# EAGLE design LoRa Radio 915MHz v1.0 (EAGLE 9.3.2)
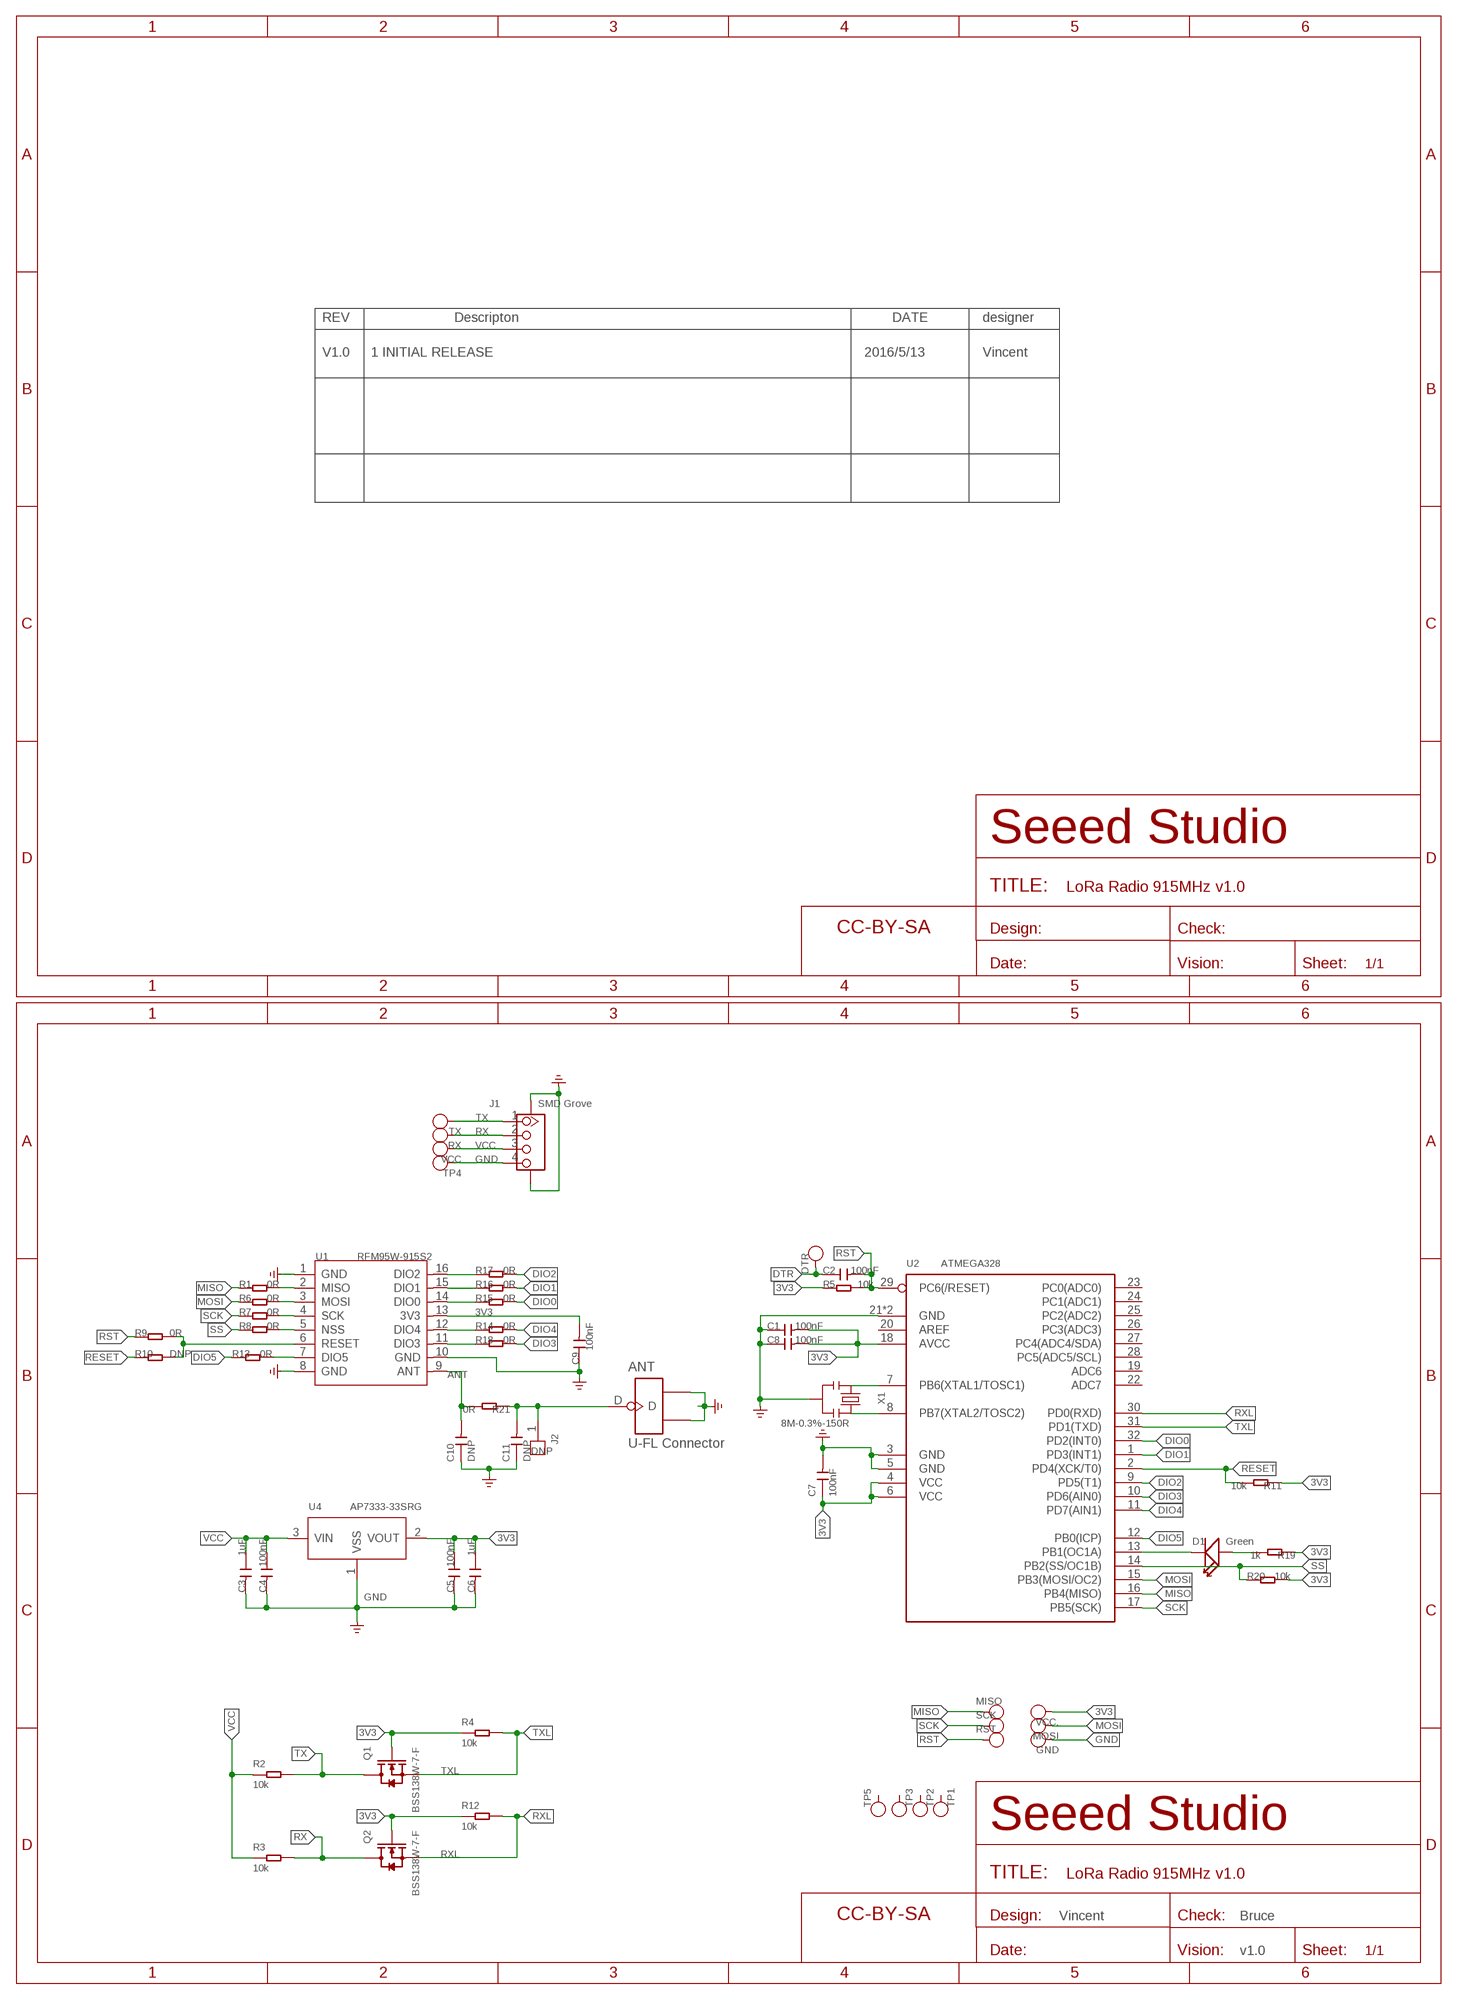
[diagram p0: schematic, sheet 1]

## Parts
ANT  U-FL Connector  ANTENNA-U-FL  [U-FL3P-SMD-2.6X2.6X1.0MM]
C1  100nF  CAP-0402  [C0402]
C2  100nF  CAP-0402  [C0402]
C3  1uF  CAP-0402  [C0402]
C4  100nF  CAP-0402  [C0402]
C5  100nF  CAP-0402  [C0402]
C6  1uF  CAP-0402  [C0402]
C7  100nF  CAP-0402  [C0402]
C8  100nF  CAP-0402  [C0402]
C9  100nF  CAP-0402  [C0402]
C10  DNP  CAP-0402  [C0402]
C11  DNP  CAP-0402  [C0402]
D1  Green  LED-0402  [LED-0402]
DTR  TEST-POINT'4545'  [TP-D45MIL]
FR1  SEEEDSTUDIO-OPEN-SCH-FRAME  [SEEEDSTUDIO-PCB-FRAME]
FR2  SEEEDSTUDIO-OPEN-SCH-FRAME  [SEEEDSTUDIO-PCB-FRAME]
GND  DNP  PAD-TEST-POINT'4545'  [TP-D45MIL]
J1  SMD Grove  GROVE-CONNECTOR-SMD'DD'  [HW4-SMD-2.0]
J2  DNP  HEADER-1P-35  [1P-65/35MIL]
MISO  DNP  PAD-TEST-POINT'4545'  [TP-D45MIL]
MOSI  DNP  PAD-TEST-POINT'4545'  [TP-D45MIL]
Q1  BSS138W-7-F  MOSFET-N'SI1304BDL'  [SOT-323]
Q2  BSS138W-7-F  MOSFET-N'SI1304BDL'  [SOT-323]
R1  0R  RES-0402  [R0402]
R2  10k  RES-0402  [R0402]
R3  10k  RES-0402  [R0402]
R4  10k  RES-0402  [R0402]
R5  10k  RES-0402  [R0402]
R6  0R  RES-0402  [R0402]
R7  0R  RES-0402  [R0402]
R8  0R  RES-0402  [R0402]
R9  0R  RES-0402  [R0402]
R10  DNP  RES-0402  [R0402]
R11  10k  RES-0402  [R0402]
R12  10k  RES-0402  [R0402]
R13  0R  RES-0402  [R0402]
R14  0R  RES-0402  [R0402]
R15  0R  RES-0402  [R0402]
R16  0R  RES-0402  [R0402]
R17  0R  RES-0402  [R0402]
R18  0R  RES-0402  [R0402]
R19  1k  RES-0402  [R0402]
R20  10k  RES-0402  [R0402]
R21  0R  R-0603  [R0603]
RST  DNP  PAD-TEST-POINT'4545'  [TP-D45MIL]
RX  TEST-POINT'4545'  [TP-D45MIL]
SCK  DNP  PAD-TEST-POINT'4545'  [TP-D45MIL]
TP1  TEST-POINT'4545'  [TP-D45MIL]
TP2  TEST-POINT'4545'  [TP-D45MIL]
TP3  TEST-POINT'4545'  [TP-D45MIL]
TP4  TEST-POINT'4545'  [TP-D45MIL]
TP5  TEST-POINT'4545'  [TP-D45MIL]
TX  TEST-POINT'4545'  [TP-D45MIL]
U1  RFM95W-915S2  MOUDLE-MODEM-RFM95/96/97/98  [MODEM16-2-16X16X1.8MM]
U2  ATMEGA328  MCU-ATMEGA8/168/328MU  [QFN32G-0.5-5X5MM]
U4  AP7333-33SRG  PMIC-XC6206PMR  [SOT-23]
VCC  TEST-POINT'4545'  [TP-D45MIL]
VCC.  NC  PAD-TEST-POINT'4545'  [TP-D45MIL]
X1  8M-0.3%-150R  CRYSTAL-RESONATOR'SMD'  [RESONATOR3-SMD-3.6X1.3X0.8MM]

## Nets
3V3: C1.2 C5.1 C6.1 C7.1 C8.2 C9.2 Q1.1(G) Q2.1(G) R4.1 R5.2 R11.2 R12.1 R19.2 R20.2 U1.13(3V3) U2.4(VCC) U2.6(VCC) U2.18(AVCC) U4.2(VOUT) VCC..T
ANT: C10.2 R21.2 U1.9(ANT)
DIO0: R15.2 U2.32(PD2(INT0))
DIO1: R16.2 U2.1(PD3(INT1))
DIO2: R17.2 U2.9(PD5(T1))
DIO3: R18.2 U2.10(PD6(AIN0))
DIO4: R14.2 U2.11(PD7(AIN1))
DIO5: R13.1 U2.12(PB0(ICP))
DTR: C2.1 DTR.T
GND: ANT.GND1 ANT.GND2 C1.1 C3.2 C4.2 C5.2 C6.2 C7.2 C8.1 C9.1 C10.1 C11.1 GND.T J1.4 J1.SS1 J1.SS2 TP4.T U1.1(GND) U1.8(GND) U1.10(GND) U2.3(GND) U2.5(GND) U2.21(GND) U2.33(GND) U4.1(VSS) X1.2 ; supply symbol labelled GND_POWER
MISO: MISO.T R1.1 U2.16(PB4(MISO))
MOSI: MOSI.T R6.1 U2.15(PB3(MOSI/OC2))
N$1: R13.2 U1.7(DIO5)
N$2: R17.1 U1.16(DIO2)
N$3: R9.1 R10.1 U1.6(RESET)
N$4: R16.1 U1.15(DIO1)
N$5: R15.1 U1.14(DIO0)
N$6: R14.1 U1.12(DIO4)
N$7: R1.2 U1.2(MISO)
N$8: R6.2 U1.3(MOSI)
N$9: R7.2 U1.4(SCK)
N$10: R8.2 U1.5(NSS)
N$11: R18.1 U1.11(DIO3)
N$12: D1.- U2.13(PB1(OC1A))
N$13: D1.+ R19.1
N$14: ANT.D C11.2 J2.1 R21.1
RESET: R10.2 R11.1 U2.2(PD4(XCK/T0))
RST: C2.2 R5.1 R9.2 RST.T U2.29(PC6(/RESET))
RX: J1.2 Q2.3(D) R3.2 RX.T
RXL: Q2.2(S) R12.2 U2.30(PD0(RXD))
SCK: R7.1 SCK.T U2.17(PB5(SCK))
SS: R8.1 R20.1 U2.14(PB2(SS/OC1B))
TX: J1.1 Q1.3(D) R2.2 TX.T
TXL: Q1.2(S) R4.2 U2.31(PD1(TXD))
VCC: C3.1 C4.1 J1.3 R2.1 R3.1 U4.3(VIN) VCC.T
XTAL1: U2.7(PB6(XTAL1/TOSC1)) X1.1
XTAL2: U2.8(PB7(XTAL2/TOSC2)) X1.3
Unconnected: TP1.T TP2.T TP3.T TP5.T U2.19(ADC6) U2.20(AREF) U2.22(ADC7) U2.23(PC0(ADC0)) U2.24(PC1(ADC1)) U2.25(PC2(ADC2)) U2.26(PC3(ADC3)) U2.27(PC4(ADC4/SDA)) U2.28(PC5(ADC5/SCL))

## Notes on the sheet
- REV | Descripton | DATE | designer
- V1.0 | 1 INITIAL RELEASE | 2016/5/13 | Vincent
- Vincent | Bruce
- v1.0

## Library data of the parts
ANT = Connector-new:ANTENNA-U-FL: 320110048
C1-C11 = Discrete-new:CAP: Ceramic Capacitors
D1 = Discrete-new:LED
DTR RX TP1-TP5 TX VCC = Discrete-new:TEST-POINT; PARTNO: DNP
FR1 FR2 = moudle-new:SEEEDSTUDIO-OPEN-SCH-FRAME
GND MISO MOSI RST SCK VCC. = Discrete-new:PAD-TEST-POINT; PARTNO: DNP
J1 = Connector-new:GROVE-CONNECTOR-SMD: 4P-SMD-2.0:320110030;4P-SMD-2.0-90D:320110032
J2 = Connector-new:HEADER-1P
Q1 Q2 = Discrete-new:MOSFET-N
R1-R20 = Discrete-new:RES
R21 = Discrete-smallsmall:R*
U1 = moudle-new:MOUDLE-MODEM-RFM95/96/97/98
U2 = IC-new:MCU-ATMEGA8/168/328
U4 = IC-new:PMIC-XC6206P: LOW ESR Cap.Compatible Positive Voltage Regulators
X1 = Discrete-new:CRYSTAL-RESONATOR: Resonator Small SMD resonator. This is the itty bitty 10/20MHz resonators with built in caps. CSTCE10M0G55 and CSTCE20M0V53. Footprint has been reviewed closely but hasn't been tested yet.

## Net classes
0 default: width 0.152 mm, drill 0.254 mm, clearance 0.152 mm

## Board
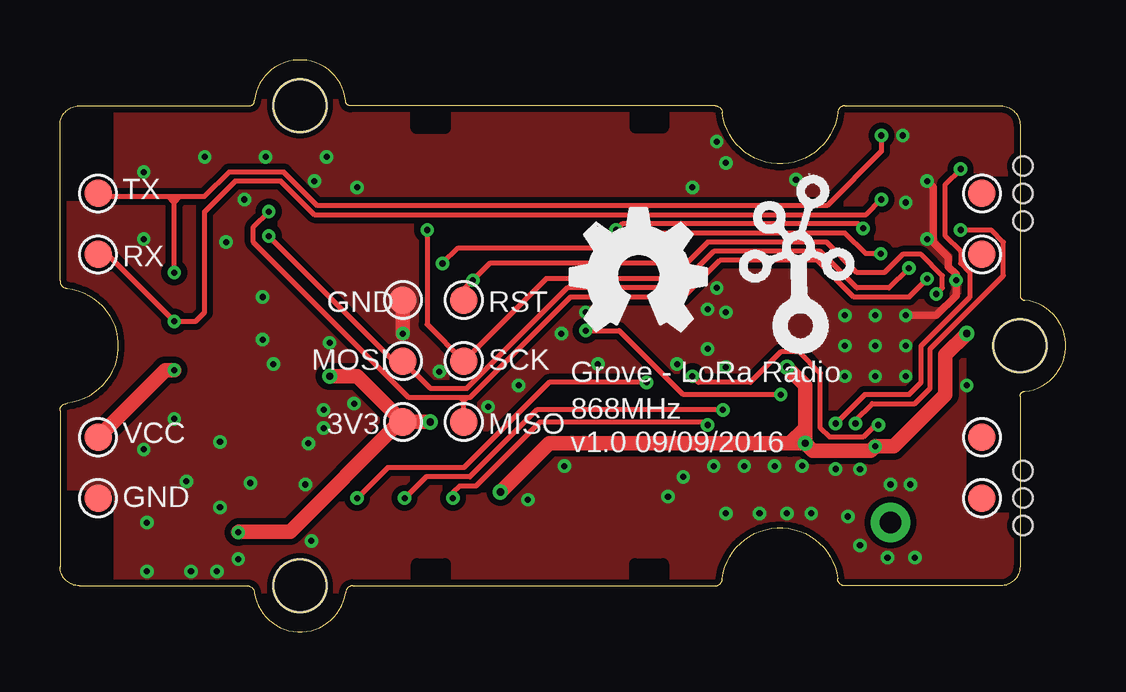
[diagram p1: board, top side]
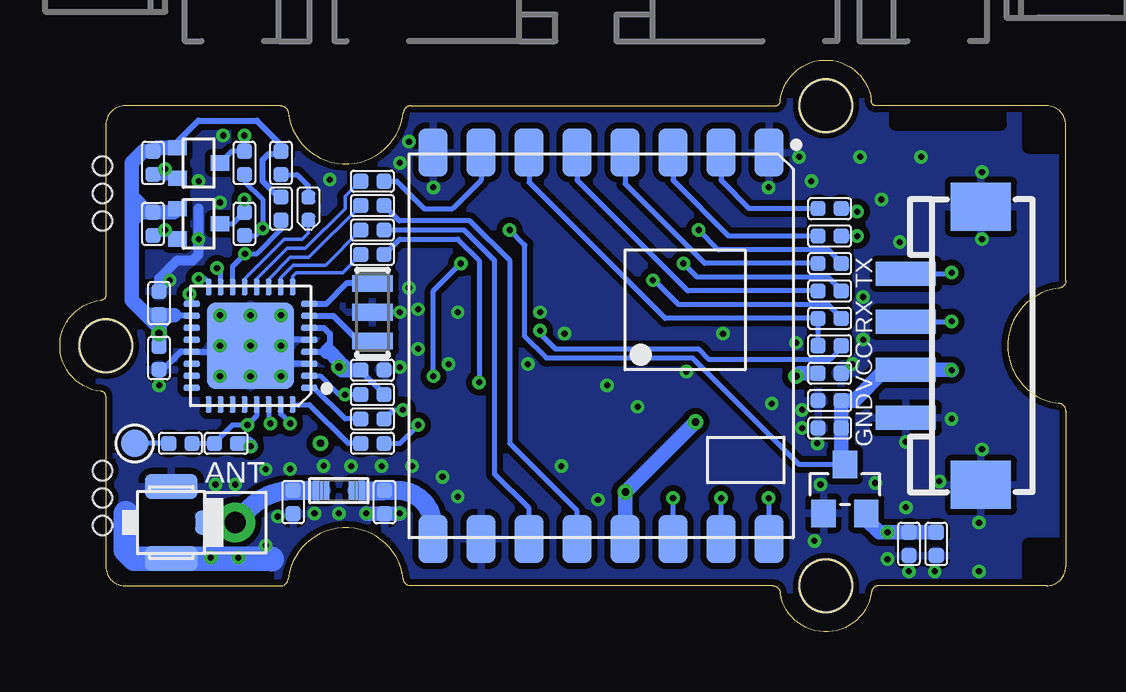
[diagram p2: board, bottom side, seen from below]

Size 41.91 x 23.83 mm. Coordinates in mm from the lower left corner, seen from the top.
Copper layers (1*16): Top 0.035mm / dielectric 1.5mm / Bottom 0.035mm
Design rules "SeeedStudio_2layer_DRU_no_angle_20140221 *": minimum track width 6mil, minimum drill 10mil, track to track 6mil, track to pad 6mil, pad to pad 6mil, via to via 6mil, smd to smd 0mil, copper to edge 10mil, drill to drill 10mil, minimum pad ring 10mil, minimum via ring 6mil, stop-mask expansion 2mil, vias tented up to drill 25mil, thermal gap 10mil
Holes 0.8 mm at 40.13,6.71 40.13,4.43 40.13,5.57 40.13,19.41 40.13,17.13 40.13,18.27

### Footprints (pad centres in the part's own frame; a part is rotated, then mirrored left to right if it is on the bottom)
U-FL3P-SMD-2.6X2.6X1.0MM = smd 1.05 x 1: D -1.524,0 | smd 2.2 x 1.05: GND1 0,1.5; GND2 0,-1.5
C0402 = smd 0.635 x 0.635: 1 0,0.484; 2 0,-0.484
LED-0402 = smd 0.58 x 0.58: + -0.468,0; - 0.468,0
TP-D45MIL = smd 1.143 x 1.143: T 0,0
HW4-SMD-2.0 = smd 1 x 2.5: 1 -3,0; 2 -1,0; 3 1,0; 4 3,0 | smd 2 x 2.5: SS1 -5.8,3.123; SS2 5.8,3.123
1P-65/35MIL = drill 0.889 pad 1.651: 1 0,0
SOT-323 = smd 0.635 x 0.762: 1 -0.635,-0.889; 2 0.635,-0.889; 3 0,0.889
R0402 = smd 0.635 x 0.635: 1 0,0.484; 2 0,-0.484
R0603 = smd 0.7 x 0.8: 1 -0.75,0; 2 0.75,0
MODEM16-2-16X16X1.8MM = smd 2 x 1.2: 1 -8.046,7; 2 -8.046,5; 3 -8.046,3; 4 -8.046,1; 5 -8.046,-1; 6 -8.046,-3; 7 -8.046,-5; 8 -8.046,-7; 9 8.046,-7; 10 8.046,-5; 11 8.046,-3; 12 8.046,-1; 13 8.046,1; 14 8.046,3; 15 8.046,5; 16 8.046,7
QFN32G-0.5-5X5MM = smd 0.7 x 0.25: 1 -2.45,1.75; 2 -2.45,1.25; 3 -2.45,0.75; 4 -2.45,0.25; 5 -2.45,-0.25; 6 -2.45,-0.75; 7 -2.45,-1.25; 8 -2.45,-1.75; 17 2.45,-1.75; 18 2.45,-1.25; 19 2.45,-0.75; 20 2.45,-0.25; 21 2.45,0.25; 22 2.45,0.75; 23 2.45,1.25; 24 2.45,1.75 | smd 0.25 x 0.7: 9 -1.75,-2.45; 10 -1.25,-2.45; 11 -0.75,-2.45; 12 -0.25,-2.45; 13 0.25,-2.45; 14 0.75,-2.45; 15 1.25,-2.45; 16 1.75,-2.45; 25 1.75,2.45; 26 1.25,2.45; 27 0.75,2.45; 28 0.25,2.45; 29 -0.25,2.45; 30 -0.75,2.45; 31 -1.25,2.45; 32 -1.75,2.45 | smd 3.6 x 3.6: 33 0,0
SOT-23 = smd 1.016 x 1.143: 1 -0.889,-1.016; 2 0.889,-1.016; 3 0,1.016
GROVE-1*2-TEST-PLATFORM-TOP = hole 2.2: 10.635,10; 10.635,-10; -19.365,0
RESONATOR3-SMD-3.6X1.3X0.8MM = smd 0.7 x 1.7: 1 -1.2,0; 2 0,0; 3 1.2,0

### Placement (x,y rotation side)
ANT  37.27,4.56 180 bottom
C1  37.78,13.7 0 bottom
C2  36.89,7.86 90 bottom
C3  9.84,9.64 270 bottom
C4  9.84,8.49 270 bottom
C5  5.4,3.67 0 bottom
C6  6.54,3.67 0 bottom
C7  28.89,10.91 90 bottom
C8  37.78,11.41 180 bottom
C9  9.84,10.78 270 bottom
C10  28.38,5.41 180 bottom
C11  32.19,5.41 180 bottom
D1  31.56,17.64 270 bottom
DTR  38.8,7.86 180 bottom
FR1  45.91,-14.37 0 bottom  (outside the outline)
FR2  50.73,-21.48 0 bottom  (outside the outline)
GND  14.29,13.83 0 top
J1  6.67,11.92 270 bottom
J2  34.61,4.56 0 bottom
MISO  16.83,8.75 0 top
MOSI  14.29,11.29 0 top
Q1  36.13,19.54 270 bottom
Q2  36.13,17 270 bottom
R1  9.84,17.64 270 bottom
R2  34.22,19.54 180 bottom
R3  34.22,17 180 bottom
R4  38.03,19.54 0 bottom
R5  34.99,7.86 90 bottom
R6  9.84,16.49 270 bottom
R7  9.84,15.35 270 bottom
R8  9.84,14.21 270 bottom
R9  9.84,13.06 90 bottom
R10  9.84,11.92 90 bottom
R11  28.89,9.89 90 bottom
R12  38.03,17 0 bottom
R13  28.89,18.78 90 bottom
R14  28.89,17.76 270 bottom
R15  28.89,7.86 270 bottom
R16  28.89,8.87 270 bottom
R17  28.89,15.73 270 bottom
R18  28.89,16.75 270 bottom
R19  32.7,19.54 180 bottom
R20  32.7,17.64 180 bottom
R21  30.29,5.89 0 bottom
RST  16.83,13.83 0 top
RX  1.59,15.73 180 top
SCK  16.83,11.29 0 top
TP1  38.42,5.57 0 top
TP2  38.42,15.73 180 top
TP3  38.42,18.27 180 top
TP4  1.59,5.57 180 top
TP5  38.42,8.11 180 top
TX  1.59,18.27 0 top
U1  19.37,11.92 270 bottom
U2  33.97,11.92 180 bottom
U4  9.21,5.95 0 bottom
U$2  [OSHW_FILLX200_NOTEXT]  21.27,12.56 0 top
U$4  [GROVE-1*2-TEST-PLATFORM-TOP]  20.64,11.92 0 bottom
U$8  [GROVE-SILK-BIG]  30.8,12.56 0 top
VCC  1.59,8.11 180 top
VCC.  14.29,8.75 0 top
X1  28.89,13.32 90 bottom

### Tracks (layer width: path | path; a pad name or v marks a point on that pad's centre or on a via)
3V3  (via drill 0.25 pad 0.51, 0.3 pad 0.64)
  Top 0.61: v15.43,8.75 VCC..T 14.16,8.75 | v37.78,12.43 36.89,11.54 36.89,9.89 34.73,7.73 v33.97,7.73 33.78,7.54 31.37,7.54 v31.05,7.86 | 14.16,8.75 9.59,4.17 7.45,4.17 v7.43,4.15 | 14.16,8.75 14.16,8.87 12.38,10.65 v11.24,10.65 | v31.05,7.86 31.05,8.49 | 31.05,8.49 31.05,10.27 v30.29,11.03 | v31.05,7.86 30.41,7.86 | 30.41,7.86 20.38,7.86 v18.35,5.83 | 30.41,7.86 31.05,8.49
  Bottom 0.254: U2.6 30.91,12.67 30.67,12.43 30.67,12.05 | 30.67,12.05 30.67,11.67 | U2.4 30.8,11.67 | 30.67,12.05 30.92,11.79 | U2.18 37.12,13.17 37.14,13.19 | R11.2 28.41,9.91 29.37,10.88 C7.1 | Q1.1 37.02,20.43 36.14,21.31 33.7,21.31 32.7,20.3 R19.2 | 32.7,19.92 R19.2 | R20.2 32.8,18.12 33.46,18.78 33.46,19.67 33.21,19.92 32.8,19.92 R19.2
  Bottom 0.61: U1.13 18.37,3.79 | 18.37,3.79 18.37,3.43 18.35,3.41 18.36,3.41 18.37,3.42 | 30.8,11.67 30.67,11.67 30.29,11.29 | 30.29,11.29 v30.29,11.03 30.16,10.91 C7.1 | 30.03,11.03 30.29,11.29 | 37.4,13.19 37.76,13.19 | 37.76,13.19 C1.2 38.31,13.22 38.92,13.83 38.92,17.13 | 37.76,13.19 37.76,12.45 v37.78,12.43 | v37.78,12.43 37.78,12.68 38.29,13.19 | 37.14,13.19 37.4,13.19 | 37.4,13.19 37.78,12.81 | C8.2 v37.78,12.43 | 18.37,5.81 v18.35,5.83 | v18.35,5.83 v15.43,8.75 | U4.2 8.32,4.68 7.78,4.15 v7.43,4.15 5.52,4.15 | 5.52,4.15 C5.1 | C6.1 5.52,4.15 | C9.2 11.11,10.78 v11.24,10.65 | 38.92,17.13 38.92,17.51 | 38.92,17.51 38.92,19.54 38.44,20.03 R4.1 37.88,20.18 Q1.1 | R12.1 38.9,17.49 38.92,17.51 | R12.1 37.17,17.49 Q2.1 | R12.1 38.26,17.49 38.8,18.02 | R12.1 38.57,17.49 38.92,17.13 | v18.35,5.83 18.35,3.81 18.37,3.79 | R5.2 34.1,7.86 v33.97,7.73
ANT
  Bottom 0.61: 26.37,3.42 26.37,3.79 U1.9
  Bottom 0.711: 26.35,3.89 U1.9 | 26.37,3.79 26.35,3.81 26.35,4.35
  Bottom 0.787: R21.2 C10.2 27.84,5.89 arc90 26.37,4.41 26.37,3.42
DIO0
  Bottom 0.203: U2.32 31.52,9.47 29.91,7.86 R15.2
DIO1
  Bottom 0.203: R16.2 30.03,8.87 31.33,10.17 U2.1
DIO2
  Bottom 0.152: U2.9 32.22,14.81 32.06,14.97 30.14,14.97 R17.2
DIO3
  Bottom 0.152: U2.10 32.72,14.76 32.19,15.29 30.84,15.29 R18.2
DIO4
  Bottom 0.152: U2.11 33.22,14.7 32.32,15.6 31.53,15.6 R14.2
DIO5
  Bottom 0.152: U2.12 33.72,14.71 32.45,15.99 31.68,15.99 30.03,17.64 30.03,18.14 29.4,18.78 R13.1
DTR
  Bottom 0.203: C2.1 DTR.T
GND  (via drill 0.25 pad 0.51)
  Top 0.305: v35.24,13.19 36.51,13.19 37.34,14.02 v37.34,14.65 37.34,14.91 37.02,15.22 37.02,15.6 36.38,16.24 36.38,18.53 v36.13,18.78
  Top 0.61: GND.T v14.29,12.43
  Bottom 0.254: U2.5 32.45,12.17 v32.7,11.92 | U2.3 32.18,11.17 v32.7,10.65 | v35.24,11.92 35.49,11.67 U2.21 36.89,11.67 37.63,10.93 C8.1 v37.78,10.27
  Bottom 0.305: C1.1 37.78,14.21 37.4,14.59
  Bottom 0.406: C9.1 9.27,10.78 v8.89,11.16 | ANT.GND1 35.66,3.06 v35.62,3.1 v34.48,3.1 33.84,3.1 v33.34,3.6 | C1.1 37.78,14.72 37.02,15.48 36.38,15.48 36.13,15.73 36.13,17.64
  Bottom 0.61: v29.14,4.94 29.13,4.92 C10.1 27.76,4.92 v27.75,4.94
  Bottom 1.016: 39.18,4.94 39.18,3.41 38.82,3.06 ANT.GND1 33.11,3.06 33.08,3.03
  other vias: 33.97,11.92 35.24,10.65 33.97,10.65 32.7,13.19 33.97,13.19 33.34,6.78 34.61,6.14 35.43,6.14 32.32,6.79 30.92,6.91 29.78,6.9 28.51,6.9 27.24,6.9 10.98,8.49 10.98,9.25 3.49,16.37 3.49,19.16 4.76,8.87 3.49,7.6 3.62,2.52 7.43,3.03 5.46,2.52 10.35,7.86 11.11,19.8 10.6,18.78 8.57,19.8 6.03,19.8 22.41,11.16 19.11,10.27 25.97,6.46 25.33,5.63 10.22,6.14 6.67,7.92 5.27,6.27 15.81,10.84 35.24,17.89 30.67,18.84 12.25,9.51 7.68,18.02 6.92,16.24 8.44,13.95 8.44,12.18 11.24,12.05 6.54,2.52 10.48,3.79 27.75,11.03 27.75,13.32 25.71,11.16 26.99,11.79 27.37,14.33 26.99,13.45 25.33,13.32 20.89,12.43 21.91,13.32 17.84,9.38 6.67,5.19 3.62,4.56 36.13,16.37 27.75,19.54 27.37,20.43 7.94,6.21 35.11,20.68 32.83,4.81 31.3,4.94 30.29,4.94 21.02,6.9 19.49,5.51 26.35,18.53 12.38,18.53
  pour Top (isolate 0.254, rank 6): 40.32,22.08 -0.32,22.08 -0.32,1.76 40.32,1.76
  pour Bottom (isolate 0.254, rank 6): 40.32,22.08 -0.32,22.08 -0.32,1.76 40.32,1.76
MISO  (via drill 0.25 pad 0.51)
  Top 0.203: 16.95,9.76 17.08,9.76 21.27,13.95 25.97,13.95 27.49,15.48 31.56,15.48 33.08,13.95 35.37,13.95 v36.13,14.72 | 16.95,9.76 16.83,9.76 | 16.83,9.76 16.7,9.76 | MISO.T 16.83,9.64 | 16.83,9.64 16.83,9.76 | 16.83,9.64 16.95,9.76 | 16.83,9.64 16.7,9.76 | 16.7,9.76 14.54,9.76 8.06,16.24 8.06,16.87 v8.7,17.51
  Bottom 0.203: U2.16 35.72,14.56 35.88,14.72 v36.13,14.72 | R1.1 8.82,17.64 v8.7,17.51
MOSI  (via drill 0.25 pad 0.51)
  Top 0.203: v35.37,15.16 34.54,14.33 33.21,14.33 31.68,15.86 27.24,15.86 25.71,14.33 21.14,14.33 16.95,10.14 15.43,10.14 MOSI.T 13.9,11.29 v8.7,16.49
  Bottom 0.203: U2.15 35.22,15.01 v35.37,15.16 | R6.1 v8.7,16.49
N$1
  Bottom 0.203: 24.37,20.42 U1.7 24.37,18.82 25.55,17.64 26.73,17.64 27.87,18.78 R13.2
N$2  (via drill 0.25 pad 0.51)
  Top 0.203: v24.45,10.4 20.38,10.4 16.83,6.84 13.65,6.84 v12.38,5.57
  Bottom 0.203: R17.1 28.38,15.73 27.75,16.37 25.33,16.37 24.45,15.48 v24.45,10.4 | 12.37,3.42 U1.16 12.38,3.89 v12.38,5.57
N$3
  Bottom 0.203: R10.1 R9.1 16.7,13.06 22.37,18.73 U1.6 22.37,20.42
N$4  (via drill 0.25 pad 0.51)
  Top 0.203: v14.36,5.57 15.25,6.46 17.08,6.46 19.87,9.25 v27.62,9.25
  Bottom 0.203: R16.1 28.38,8.87 28,9.25 v27.62,9.25 | 14.37,3.42 U1.15 v14.37,5.57 v14.36,5.57
N$5  (via drill 0.25 pad 0.51)
  Top 0.203: v26.99,8.62 26.86,8.75 20,8.75 17.33,6.08 16.65,6.08 16.37,5.8 v16.37,5.57
  Bottom 0.203: R15.1 27.75,7.86 v26.99,8.62 | 16.37,3.42 U1.14 16.37,4.6 16.37,4.61 v16.37,5.57
N$6
  Bottom 0.203: R14.1 27.77,17.13 24.83,17.13 23.18,15.48 23.18,7.86 20.37,5.05 U1.12 20.37,3.42
N$7
  Bottom 0.203: R1.2 13.18,17.64 14.37,18.82 U1.2 14.37,20.38 14.41,20.43 14.37,20.43 14.37,20.42
N$8
  Bottom 0.203: R6.2 14.04,16.49 16.37,18.82 U1.3 16.37,20.42
N$9
  Bottom 0.203: R7.2 15.05,15.35 18.37,18.67 U1.4 18.37,20.42
N$10
  Bottom 0.203: R8.2 15.75,14.21 20.37,18.82 U1.5 20.37,20.41 20.38,20.43 20.37,20.43 20.37,20.42
N$11
  Bottom 0.203: 22.37,3.42 U1.11 22.37,5.14 23.81,6.59 23.81,15.48 25.08,16.75 R18.1
N$12
  Bottom 0.152: U2.13 34.22,14.72 32.57,16.37 31.81,16.37 31.56,16.62 D1.-
  Bottom 0.254: D1.- 31.56,17.26
N$13
  Bottom 0.203: R19.1 32.03,19.06 31.56,18.59 D1.+
N$14
  Bottom 0.787: ANT.D J2.1 33.99,5.17 arc45 32.25,5.89 C11.2 R21.1
RESET  (via drill 0.25 pad 0.51)
  Top 0.203: v21.91,12.56 23.3,12.56 25.97,9.89 v30.03,9.89
  Bottom 0.203: R10.2 9.36,11.83 9.84,11.35 14.86,11.35 15.3,11.79 21.27,11.79 21.91,12.43 v21.91,12.56 | U2.2 31.07,10.67 30.29,9.89 v30.03,9.89 R11.1
RST  (via drill 0.25 pad 0.51)
  Top 0.203: v25.21,15.35 17.9,15.35 v17.21,14.65 16.83,14.27 RST.T | v26.35,10.65 26.6,10.4 28.76,10.4 30.03,11.67 30.8,11.67 31.68,10.78 31.68,8.49 32.06,8.11 33.46,8.11 33.97,8.62 v34.1,8.62
  Bottom 0.203: R9.2 9.36,13.09 9.9,13.64 16.13,13.64 17.14,14.65 v17.21,14.65 | v26.35,10.65 26.35,14.21 v25.21,15.35 | U2.29 33.72,9 v34.1,8.62 34.73,8.62 35.47,7.88 R5.1 C2.2
RX  (via drill 0.25 pad 0.51)
  Top 0.203: RX.T 1.97,15.73 v4.76,12.94 5.65,12.94 6.03,13.32 6.03,17.51 7.3,18.78 9.21,18.78 10.6,17.38 33.59,17.38 v34.22,18.02
  Bottom 0.203: J1.2 4.78,12.92 v4.76,12.94 | v34.22,18.02 R3.2 34.71,17 Q2.3
RXL  (via drill 0.25 pad 0.51)
  Top 0.203: v33.14,8.68 33.14,8.81 33.84,9.51 35.62,9.51 36.26,10.14 36.26,11.79 39.3,14.84 39.3,16.24 38.8,16.75 v37.53,16.75
  Bottom 0.203: U2.30 33.22,8.76 v33.14,8.68 | Q2.2 37.17,16.52 37.3,16.52 v37.53,16.75 37.76,16.52 R12.2
SCK  (via drill 0.25 pad 0.51)
  Top 0.203: v15.3,16.75 15.3,12.81 SCK.T 20.25,14.72 25.46,14.72 26.99,16.24 31.94,16.24 33.21,14.97 34.35,14.97 35.11,15.73 35.88,15.73 36.76,14.84 36.76,14.33 v36.51,14.08
  Bottom 0.203: R7.1 9.36,15.37 9.9,15.92 14.48,15.92 v15.3,16.75 | U2.17 36.42,13.99 v36.51,14.08
SS  (via drill 0.25 pad 0.51)
  Top 0.203: v15.94,15.35 16.57,15.99 23.43,15.99 24.06,16.62 32.7,16.62 33.56,15.76 v34.2,15.76
  Bottom 0.203: R8.1 9.36,14.23 9.9,14.78 15.37,14.78 v15.94,15.35 | U2.14 34.72,15.24 v34.2,15.76 33.69,15.76 32.7,16.75 R20.1
TX  (via drill 0.25 pad 0.51)
  Top 0.203: TX.T 1.59,18.14 4.51,18.14 | v4.76,14.97 4.76,17.89 | 4.76,17.89 4.76,18.14 | 4.51,18.14 4.76,18.14 | 4.76,18.14 5.01,18.14 | 5.01,18.14 6.03,18.14 7.05,19.16 9.33,19.16 10.73,17.76 31.96,17.76 R2.2 v34.22,20.68 | 4.76,17.89 5.01,18.14 | 4.76,17.89 4.51,18.14
  Bottom 0.203: J1.1 4.81,14.92 v4.76,14.97 | Q1.3 34.76,20.03 R2.2 34.22,20.05
  Bottom 0.254: 34.22,20.05 v34.22,20.68
TXL  (via drill 0.25 pad 0.51)
  Top 0.203: v32.32,8.68 33.53,9.89 35.37,9.89 35.88,10.4 35.88,11.92 37.91,13.95 37.91,14.97 37.53,15.35 37.53,15.86 36.89,16.49 36.89,18.65 v37.53,19.29
  Bottom 0.203: U2.31 32.72,9.08 v32.32,8.68 | v37.53,19.29 37.53,19.03 | Q1.2 37.4,18.91 | 37.4,18.91 37.53,18.91 | 37.53,18.91 37.65,18.91 | 37.65,18.91 37.88,18.91 R4.2 | 37.4,18.91 37.53,19.03 | 37.53,19.03 37.65,18.91 | 37.53,18.91 37.53,19.03
VCC  (via drill 0.25 pad 0.51)
  Top 0.203: v23.18,16.75 23.43,17 33.27,17 v33.46,16.81
  Top 0.61: v4.76,10.91 4.38,10.91 VCC.T
  Bottom 0.203: U4.3 11.11,6.97 15.56,11.41 21.65,11.41 22.54,12.3 22.54,16.11 v23.18,16.75 | R3.1 33.76,16.52 v33.46,16.81 33.46,18.02 34.22,18.78 R2.1
  Bottom 0.61: U4.3 9.36,7.12 C4.1 C3.1 8.82,9.64 7.54,10.92 J1.3 4.78,10.92 v4.76,10.91
XTAL1
  Bottom 0.254: U2.7 30.52,13.17 29.47,12.12 X1.1
XTAL2
  Bottom 0.254: U2.8 30.82,13.67 29.98,14.52 X1.3

### Text on the board
tPlace: Grove - LoRa Radio | 868MHz | 3V3
bPlace: TX | RX | VCC | GND
tNames: v1.0 09/09/2016 | GND
bNames: ANT